# Altium schematic sheet Ethernet.SchDoc
size A2; SheetNumber: 3; SheetTotal: 8
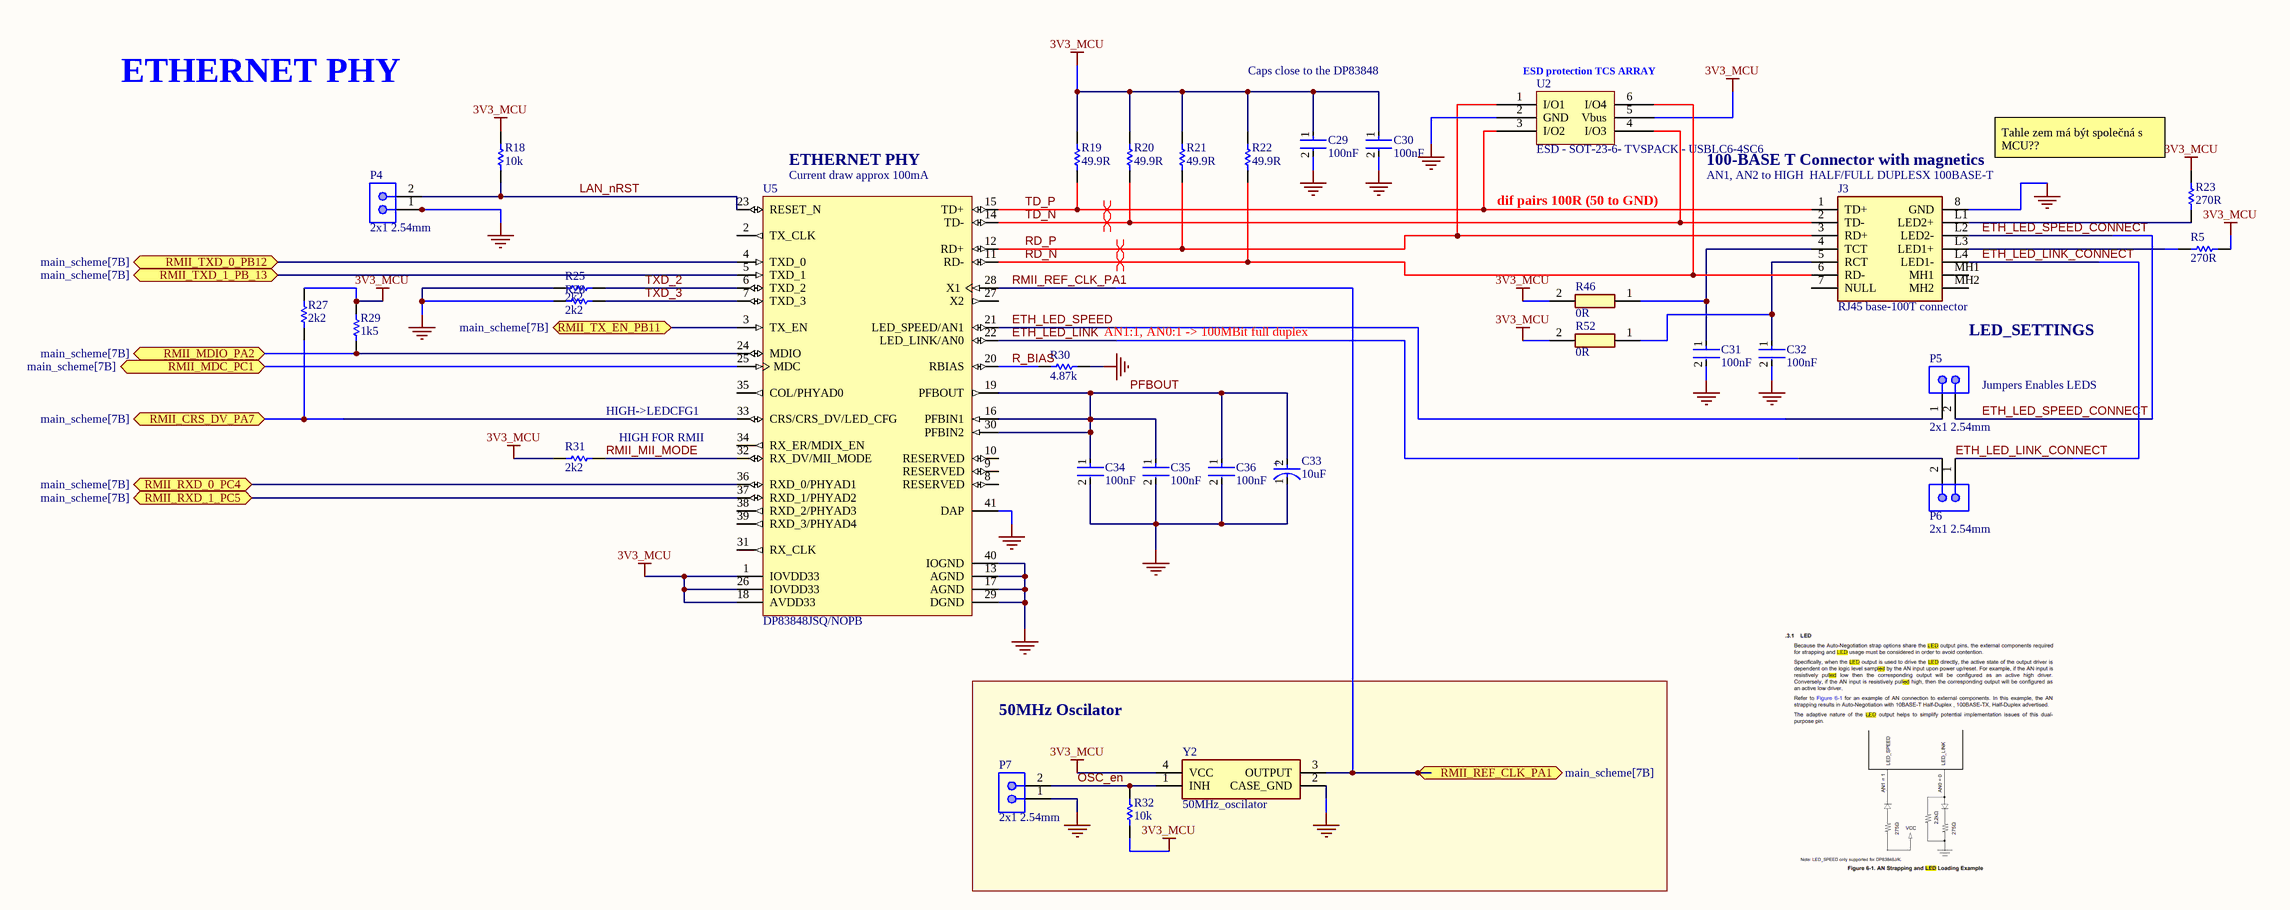
[diagram p0: Ethernet.SchDoc]

## Parts
C29  100nF  [0402 CAP]
C30  100nF  [0402 CAP]
C31  100nF  [0402 CAP]
C32  100nF  [0402 CAP]
C33  10uF  [0603_tantal]
C34  100nF  [0402 CAP]
C35  100nF  [0402 CAP]
C36  100nF  [0402 CAP]
J3  RJ45 base-100T connector  [ARJM11D7009ABEW2 - better3D]
P4  2x1 2.54mm  [2.54mm header 2x1]
P5  2x1 2.54mm  [2.54mm header 2x1]
P6  2x1 2.54mm  [2.54mm header 2x1]
P7  2x1 2.54mm  [2.54mm header 2x1]
R5  270R  [RESC1005X40X25NL05T05]
R18  10k  [RESC1005X40X25NL05T05]
R19  49.9R  [RESC1005X40X25NL05T05]
R20  49.9R  [RESC1005X40X25NL05T05]
R21  49.9R  [RESC1005X40X25NL05T05]
R22  49.9R  [RESC1005X40X25NL05T05]
R23  270R  [RESC1005X40X25NL05T05]
R25  2k2  [RESC1005X40X25NL05T05]
R27  2k2  [RESC1005X40X25NL05T05]
R28  2k2  [RESC1005X40X25NL05T05]
R29  1k5  [RESC1005X40X25NL05T05]
R30  4.87k  [RESC1005X40X25NL05T05]
R31  2k2  [RESC1005X40X25NL05T05]
R32  10k  [RESC1005X40X25NL05T05]
R46  0R  [0603- SMD resistor]
R52  0R  [0603- SMD resistor]
U2  ESD - SOT-23-6- TVSPACK - USBLC6-4SC6  [SOT95P280X145-6N]
U5  DP83848JSQ/NOPB  [RTA0040A_V]
Y2  50MHz_oscilator  [KC2016Z500000C15XXK]

## Blocks framed on the sheet
50MHz Oscilator: P7 R32 Y2

## Ports
RMII_CRS_DV_PA7 (bidir, see main_scheme[7B]), RMII_MDC_PC1 (bidir, see main_scheme[7B]), RMII_MDIO_PA2 (bidir, see main_scheme[7B]), RMII_REF_CLK_PA1 (bidir, see main_scheme[7B]), RMII_RXD_0_PC4 (bidir, see main_scheme[7B]), RMII_RXD_1_PC5 (bidir, see main_scheme[7B]), RMII_TX_EN_PB11 (bidir, see main_scheme[7B]), RMII_TXD_0_PB12 (bidir, see main_scheme[7B]), RMII_TXD_1_PB_13 (bidir, see main_scheme[7B])

## Nets
3V3_MCU: C29.1 C30.1 R5.1 R18.1 R19.1 R20.1 R21.1 R22.1 R23.1 R27.1 R29.1 R31.1 R32.2 R46.2 R52.2 U2.5(Vbus) U5.1(IOVDD33) U5.18(AVDD33) U5.26(IOVDD33) Y2.4(VCC)
GND: C29.2 C30.2 C31.2 C32.2 C33.1(C) C34.2 C35.2 C36.2 J3.8(GND) P4.1 P7.1 R25.2 R28.2 R30.1 U2.2(GND) U5.13(AGND) U5.17(AGND) U5.29(DGND) U5.40(IOGND) U5.41(DAP) Y2.2(CASE_GND)
ETH_LED_LINK: P6.2 U5.22(LED_LINK/AN0)
ETH_LED_LINK_CONNECT: J3.L4(LED1-) P6.1
ETH_LED_SPEED: P5.1 U5.21(LED_SPEED/AN1)
ETH_LED_SPEED_CONNECT: J3.L2(LED2-) P5.2
LAN_nRST: P4.2 R18.2 U5.23(RESET_N)
OSC_en: P7.2 R32.1 Y2.1(INH)
PFBOUT: C33.2(A) C34.1 C35.1 C36.1 U5.16(PFBIN1) U5.19(PFBOUT) U5.30(PFBIN2)
R_BIAS: R30.2 U5.20(RBIAS)
RD_N: J3.6(RD-) R22.2 U2.6(I/O4) U5.11(RD-)
RD_P: J3.3(RD+) R21.2 U2.1(I/O1) U5.12(RD+)
RMII_CRS_DV_PA7: R27.2 U5.33(CRS/CRS_DV/LED_CFG) ; port RMII_CRS_DV_PA7
RMII_MDC_PC1: U5.25(MDC) ; port RMII_MDC_PC1
RMII_MDIO_PA2: R29.2 U5.24(MDIO) ; port RMII_MDIO_PA2
RMII_MII_MODE: R31.2 U5.32(RX_DV/MII_MODE)
RMII_REF_CLK_PA1: U5.28(X1) Y2.3(OUTPUT) ; port RMII_REF_CLK_PA1
RMII_RXD_0_PC4: U5.36(RXD_0/PHYAD1) ; port RMII_RXD_0_PC4
RMII_RXD_1_PC5: U5.37(RXD_1/PHYAD2) ; port RMII_RXD_1_PC5
RMII_TX_EN_PB11: U5.3(TX_EN) ; port RMII_TX_EN_PB11
RMII_TXD_0_PB12: U5.4(TXD_0) ; port RMII_TXD_0_PB12
RMII_TXD_1_PB_13: U5.5(TXD_1) ; port RMII_TXD_1_PB_13
TD_N: J3.2(TD-) R20.2 U2.4(I/O3) U5.14(TD-)
TD_P: J3.1(TD+) R19.2 U2.3(I/O2) U5.15(TD+)
TXD_2: R25.1 U5.6(TXD_2)
TXD_3: R28.1 U5.7(TXD_3)
NetC31_1: C31.1 J3.4(TCT) R46.1
NetC32_1: C32.1 J3.5(RCT) R52.1
NetJ3_L1: J3.L1(LED2+) R23.2
NetJ3_L3: J3.L3(LED1+) R5.2

Not connected (* = marked no-connect by the designer): J3 7(NULL) MH1 MH2; U5 2(TX_CLK) 8(RESERVED) 9(RESERVED) 10(RESERVED) 27(X2) 31(RX_CLK) 34(RX_ER/MDIX_EN) 35(COL/PHYAD0) 38(RXD_2/PHYAD3) 39(RXD_3/PHYAD4)

## Layout directives
differential pair; differential pair class ETH_RD_DIFF: RD_N, RD_P
differential pair; differential pair class ETH_TD_DIFF: TD_N, TD_P

## Notes on the sheet
- ETHERNET PHY
- Caps close to the DP83848
- (near U2) ESD protection TCS ARRAY
- (near U5) Current draw approx 100mA
- (near U5) ETHERNET PHY
- (near J3) AN1, AN2 to HIGH  HALF/FULL DUPLESX 100BASE-T
- (near J3) 100-BASE T Connector with magnetics
- (near R23) Tahle zem má být společná s MCU??
- dif pairs 100R (50 to GND)
- (near R30) AN1:1, AN0:1 -> 100MBit full duplex
- LED_SETTINGS
- (near P5) Jumpers Enables LEDS
- (near R31) HIGH->LEDCFG1
- (near R31) HIGH FOR RMII
- (in symbol CAP 0603 Tantal -10uF) +

## Library data of the parts
C29-C32 C34-C36 = CAP 0402 - 100nF: Cap Ceramic 0402,0.1uF, 25V,10%; PartNumber: C0402C104K3RACTU; Value: 100nF; Package: 0402; Supplier 1: Mouser; Supplier Part Number 1: 80-C0402C104K3R; ComponentLink1Description: myLinks; ComponentLink1URL: https://eu.mouser.com/ProductDetail/KEMET/C0402C104K3RACTU?qs=YCcZ0GhAU2q7BaxZ%2FluQHA%3D%3D
C33 = CAP 0603 Tantal -10uF: CAP TANT POLY 10UF 10V 0603 20%; PartNumber: F381A106MMAAH1; Package: 0603; Value: 10uF; ComponentLink1Description: myLinks; ComponentLink1URL: https://cz.mouser.com/ProductDetail/KYOCERA-AVX/F381A106MMAAH1?qs=sGAEpiMZZMtZ1n0r9vR22Q2XOsfGOI9effSA9nDSSSNE17O0WlLegw%3D%3D; Supplier 1: Mouser; Supplier Part Number 1: 581-F381A106MMAAH1
J3 = RJ45 base-100T connector: Connector RJ45 base-100T CAT5/6, with magnetics inside; PartNumber: ARJM11D7-009-AB-EW2; Value: 100BASE-T with magnetics; ComponentLink1Description: myLinks; ComponentLink1URL: https://cz.mouser.com/ProductDetail/ABRACON/ARJM11D7-009-AB-EW2?qs=YCa%2FAAYMW01wgGAVSiGYdQ%3D%3D; Package: RJ45 with magnetics; Supplier 1: Mouser; Supplier Part Number 1: 815-RJM11D7009ABEW2
P4-P7 = Header - 2x1 2.54mm: Male Header, Pitch 2.54 mm, 1 x 2 Position, Height 8.21 mm, Tail Length 3.05 mm, -65 to 105 degC, RoHS, Bulk; PartNumber: 5-146280-2; ComponentLink1Description: myLinks; ComponentLink1URL: https://cz.mouser.com/ProductDetail/TE-Connectivity/5-146280-2?qs=bwpFY26eRVcxHP%252BQexhLNQ%3D%3D; Value: 2x1 2.54mm; Package: 2x1 2.54mm; Supplier 1: Mouser; Supplier Part Number 1: 571-5-146280-2
R5 R23 = Resistor - 0402 -270R: Resistor - 0402 - 270R - 1% - 125mW; PartNumber: CRGP0402F270R; Value: 270R; Package: 0402; ComponentLink1Description: myLinks; ComponentLink1URL: https://cz.mouser.com/ProductDetail/TE-Connectivity-Holsworthy/CRGP0402F270R?qs=wUXugUrL1qyX8E%252BNg7WV%252Bg%3D%3D; Supplier 1: Mouser; Supplier Part Number 1: 279-CRGP0402F270R
R18 R32 = Resistor - 0402 -10k: Resistor - 0402 -  10k - 5% - 125mW; PartNumber: RC0402JR-7W10KL; Value: 10k; Package: 0402; ComponentLink1Description: myLinks; ComponentLink1URL: https://cz.mouser.com/ProductDetail/YAGEO/RC0402JR-7W10KL?qs=tggtontpCXPnY%2FhgQXv%2FLg%3D%3D; Supplier 1: Mouser; Supplier Part Number 1: 603-RC0402JR-7W10KL
R19-R22 = Resistor - 0402 - 49.9R: Resistor - 0402 -  49.9R - 1% - 100mW; PartNumber: ERJ-2RKF49R9X; Value: 49.9R; Package: 0402; ComponentLink1Description: myLinks; ComponentLink1URL: https://cz.mouser.com/ProductDetail/Panasonic/ERJ-2RKF49R9X?qs=sGAEpiMZZMtG0KNrPCHnjWXb3yLuGJ27UdsBFBOB8ls%3D; Supplier 1: Mouser; Supplier Part Number 1: 667-ERJ-2RKF49R9X
R25 R27 R28 R31 = Resistor - 0402 - 2k2: Resistor - 0402 - 2k2 - 1% - 200mW; PartNumber: ERJ-PA2F2201X; Value: 2k2; Package: 0402; ComponentLink1Description: myLinks; ComponentLink1URL: https://cz.mouser.com/ProductDetail/Panasonic/ERJ-PA2F2201X?qs=sGAEpiMZZMtG0KNrPCHnjZ6x%2FURjllozzwNvbZVeFeMwGqzVywslMw%3D%3D; Supplier 1: Mouser; Supplier Part Number 1: 667-ERJ-PA2F2201X
R29 = Resistor - 0402 - 1k5: Resistor - 0402 - 1k5 - 1% - 100mW; PartNumber: ERJ2RKF6800X; Value: 1k5; Package: 0402; ComponentLink1Description: myLinks; ComponentLink1URL: https://cz.mouser.com/ProductDetail/Panasonic/ERJ-2RKF1501X?qs=sGAEpiMZZMtG0KNrPCHnjTg0x5DoQJ5PTwSSYoQ29R0%3D; Supplier 1: Mouser; Supplier Part Number 1: 667-ERJ-2RKF6800X
R30 = Resistor - 0402 - 4.87k: Resistor - 0402 -  4.87k - 1% - 100mW; PartNumber: ERJ-2RKF4871X; Value: 4.87k; Package: 0402; ComponentLink1Description: myLinks; ComponentLink1URL: https://cz.mouser.com/ProductDetail/Panasonic/ERJ-2RKF4871X?qs=YMBIwoNQYdV9ZzOLxQ6NUw%3D%3D; Supplier 1: Mouser; Supplier Part Number 1: 667-ERJ-2RKF4871X
R46 R52 = RESISTOR - 0603 - 0R: Resistor 0603 0R; PartNumber: ERJ-3GEY0R00V; ComponentLink1Description: myLinks; ComponentLink1URL: https://cz.mouser.com/ProductDetail/Panasonic/ERJ-3GEY0R00V?qs=66DK8nO8gJALIOqOWgiVwg%3D%3D; Value: 0R; Package: 0603; Supplier 1: Mouser; Supplier Part Number 1: 667-ERJ-3GEY0R00V
U2 = ESD - SOT-23-6- TVSPACK - USBLC6-4SC6: ESD Suppressors / TVS Diodes Low Cap ESD Protect -  Working VOltage 5.25V, Br: 6V, Clamp 17V; Value: Operate:5.25V, Br: 6V, Clamp 17V; Package: SOT-23-6; PartNumber: USBLC6-4SC6; ComponentLink1Description: myLinks; ComponentLink1URL: https://cz.mouser.com/ProductDetail/STMicroelectronics/USBLC6-4SC6?qs=k9dH%2Fx4GHJCNdehb8zInZg%3D%3D; Supplier 1: Mouser; Supplier Part Number 1: 511-USBLC6-4SC6
U5 = LAN-DP83848JSQ/NOPB: PHYTER® Mini LS Commercial Temperature Single Port 10/100 Mb/s Ethernet Transceiver, 40-pin LLP, Pb-Free, 250 Reel; Value: 10/100BASE-T PHY; ComponentLink1URL: https://cz.mouser.com/ProductDetail/Texas-Instruments/DP83848JSQ-NOPB?qs=7X5t%252BdzoRHAkvw41SeKPjQ%3D%3D; PartNumber: DP83848JSQ/NOPB; ComponentLink1Description: myLinks; Package: WQFN-40; Supplier 1: Mouser; Supplier Part Number 1: 926-DP83848JSQ/NOPB
Y2 = 50MHz_oscilator: Oscilator - 50MHz - 30ppm - 15pF - 1.71 - 3.63V; PartNumber: KC2016Z50.0000C15XXK; ComponentLink1Description: myLinks; ComponentLink1URL: https://cz.mouser.com/ProductDetail/KYOCERA-AVX/KC2016Z50.0000C15XXK?qs=sGAEpiMZZMtldj7qu1ydrbV2KlGvrVWI6qQFSeMxWJ%252BAw5U4y9rW5g%3D%3D; Value: 50MHz; Package: 2x1.6mm; Supplier 1: Mouser; Supplier Part Number 1: 346-KC2016Z50.0000C1